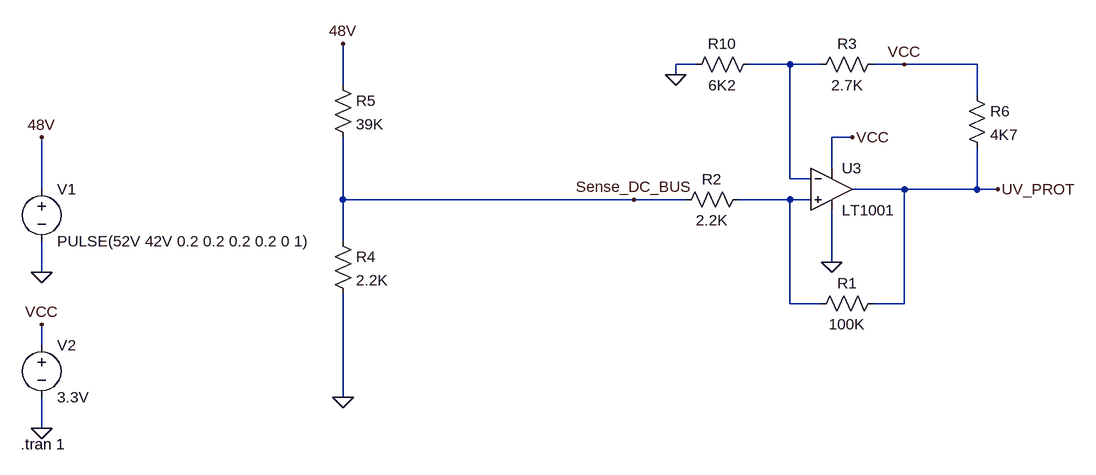
[diagram p0: schematic VoltageMeasurment.asc]
VoltageMeasurment.asc, the LTspice schematic file:
Version 4
SHEET 1 1984 864
WIRE 960 -160 928 -160
WIRE 1104 -160 1040 -160
WIRE 1152 -160 1104 -160
WIRE 1280 -160 1232 -160
WIRE 1392 -160 1280 -160
WIRE 928 -144 928 -160
WIRE 416 -128 416 -192
WIRE 1392 -112 1392 -160
WIRE 1200 -48 1168 -48
WIRE 1168 0 1168 -48
WIRE 1104 16 1104 -160
WIRE 1136 16 1104 16
WIRE -48 32 -48 -48
WIRE 1280 32 1200 32
WIRE 1392 32 1392 -32
WIRE 1392 32 1280 32
WIRE 1424 32 1392 32
WIRE 416 48 416 -48
WIRE 864 48 416 48
WIRE 944 48 864 48
WIRE 1104 48 1024 48
WIRE 1136 48 1104 48
WIRE 416 112 416 48
WIRE 1168 144 1168 64
WIRE -48 160 -48 112
WIRE 1104 208 1104 48
WIRE 1152 208 1104 208
WIRE 1280 208 1280 32
WIRE 1280 208 1232 208
WIRE -48 272 -48 240
WIRE 416 352 416 192
WIRE -48 400 -48 352
FLAG -48 240 VCC
FLAG -48 400 0
FLAG -48 160 0
FLAG -48 -48 48V
FLAG 416 352 0
FLAG 416 -192 48V
FLAG 1200 -48 VCC
FLAG 928 -144 0
FLAG 1280 -160 VCC
FLAG 1424 32 UV_PROT
FLAG 1168 144 0
FLAG 864 48 Sense_DC_BUS
SYMBOL voltage -48 16 R0
WINDOW 123 0 0 Left 0
WINDOW 39 0 0 Left 0
SYMATTR InstName V1
SYMATTR Value PULSE(52V 42V 0.2 0.2 0.2 0.2 0 1)
SYMBOL voltage -48 256 R0
WINDOW 123 0 0 Left 0
WINDOW 39 0 0 Left 0
SYMATTR InstName V2
SYMATTR Value 3.3V
SYMBOL res 400 96 R0
SYMATTR InstName R4
SYMATTR Value 2.2K
SYMBOL res 400 -144 R0
SYMATTR InstName R5
SYMATTR Value 39K
SYMBOL res 1248 192 R90
WINDOW 0 0 56 VBottom 2
WINDOW 3 32 56 VTop 2
SYMATTR InstName R1
SYMATTR Value 100K
SYMBOL res 1040 32 R90
WINDOW 0 0 56 VBottom 2
WINDOW 3 32 56 VTop 2
SYMATTR InstName R2
SYMATTR Value 2.2K
SYMBOL res 1248 -176 R90
WINDOW 0 0 56 VBottom 2
WINDOW 3 32 56 VTop 2
SYMATTR InstName R3
SYMATTR Value 2.7K
SYMBOL res 1056 -176 R90
WINDOW 0 0 56 VBottom 2
WINDOW 3 32 56 VTop 2
SYMATTR InstName R10
SYMATTR Value 6K2
SYMBOL OpAmps\\LT1001 1168 -32 R0
SYMATTR InstName U3
SYMBOL res 1376 -128 R0
SYMATTR InstName R6
SYMATTR Value 4K7
TEXT -80 424 Left 2 !.tran 1

The netlist it stands for:
* VoltageMeasurment.asc
V1 48V 0 PULSE(52V 42V 0.2 0.2 0.2 0.2 0 1)
V2 VCC 0 3.3V
R4 Sense_DC_BUS 0 2.2K
R5 48V Sense_DC_BUS 39K
R1 UV_PROT N002 100K
R2 N002 Sense_DC_BUS 2.2K
R3 VCC N001 2.7K
R10 N001 0 6K2
XU3 N002 N001 VCC 0 UV_PROT LT1001  ; pins In+ In- V+ V- OUT
R6 VCC UV_PROT 4K7
.tran 1
.lib LTC.lib
.backanno
.end